# Altium schematic sheet Sheet1.SchDoc
size B; Author: E. Sims; Organization: Let's Build Rockets Inc.; SheetNumber: 1; SheetTotal: 3
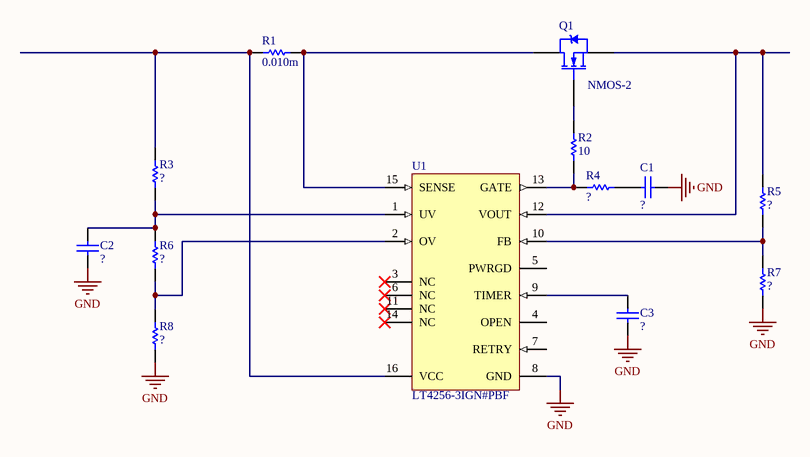
[diagram p0: Sheet1.SchDoc]

## Parts
C1  Cap  [RAD-0.3]  (value not drawn)
C2  Cap  [RAD-0.3]  (value not drawn)
C3  Cap  [RAD-0.3]  (value not drawn)
Q1  NMOS-2  [TO-220AB]
R1  value 0.010m  [AXIAL-0.3]  (hidden comment: Res1)
R2  value 10  [AXIAL-0.3]  (hidden comment: Res1)
R3  Res1  [AXIAL-0.3]  (value not drawn)
R4  Res1  [AXIAL-0.3]  (value not drawn)
R5  Res1  [AXIAL-0.3]  (value not drawn)
R6  Res1  [AXIAL-0.3]  (value not drawn)
R7  Res1  [AXIAL-0.3]  (value not drawn)
R8  Res1  [AXIAL-0.3]  (value not drawn)
U1  LT4256-3IGN#PBF  [LT-GN-16_L]

## Nets
GND: C1.1 C2.1 C3.1 R7.1 R8.1 U1.8(GND)
NetC1_2: C1.2 R4.1
NetC2_2: C2.2 R3.1 R6.2 U1.1(UV)
NetC3_2: C3.2 U1.9(TIMER)
NetQ1_1: Q1.1(G) R2.2
NetQ1_2: Q1.2(D) R1.2 U1.15(SENSE)
NetQ1_3: Q1.3(S) R5.2 U1.12(VOUT)
NetR1_1: R1.1 R3.2 U1.16(VCC)
NetR2_1: R2.1 R4.2 U1.13(GATE)
NetR5_1: R5.1 R7.2 U1.10(FB)
NetR6_1: R6.1 R8.2 U1.2(OV)

Not connected (* = marked no-connect by the designer): U1 3(NC)* 4(OPEN) 5(PWRGD) 6(NC)* 7(RETRY) 11(NC)* 14(NC)*

## Notes on the sheet
- Let's Build Rocket's Inc. Modular Paylaod System Based on TMP-010 Rev
  For more information visit https://github.com/LetsBuildRockets/Modular-Payload-System
  This work is licensed under CC BY-NC 4.0. To view a copy of this license, visit https://creativecommons.org/licenses/by-nc/4.0
- Title
- Size:
- Date:
- Assembly Variant:
- B
- Number:
- Time:
- Revision:
- Sheet
- of
- Author:
- File:

## Library data of the parts
C1-C3 = Cap: Capacitor; Published: 8-Jun-2000; LatestRevisionDate: 17-Jul-2002; LatestRevisionNote: Re-released for DXP Platform.; PackageReference: RAD-0.3; Publisher: Altium Limited; PackageDescription: Radial Cap, Thru-Hole; 2 Leads; 0.3 in Pin Spacing; Value: ?
Q1 = NMOS-2: N-Channel Power MOSFET; Note: Pin 2 is electrically connected to pin 4.; Published: 8-Jun-2000; LatestRevisionDate: 17-Jul-2002; LatestRevisionNote: Re-released for DXP Platform.; DatasheetVersion: PD-9.814; PackageVersion: Feb-1997; PackageReference: TO-220AB; Publisher: Altium Limited; PackageDescription: TO, Thru-Hole, Vertical, Heatsink Mounted; 3 In-Line Leads; Pitch 2.54 mm; ComponentLink1Description: Manufacturer Link; ComponentLink1URL: http://www.irf.com/
R1-R8 = Res1: Resistor; Published: 8-Jun-2000; LatestRevisionDate: 17-Jul-2002; LatestRevisionNote: Re-released for DXP Platform.; PackageReference: AXIAL-0.3; Publisher: Altium Limited; PackageDescription: Axial Device, Thru-Hole; 2 Leads; 0.3 in Pin Spacing
  R3-R8: Value: ?
U1 = CMP-0474-00283-1: Positive High Voltage Hot Swap Controller with Open-Circuit Detect, 10.8 to 80 V Vin, 16-pin SOP (GN-16), -40 to 85 degC, Pb-Free; Manufacturer: Linear Technology; Circuit Breaker Threshold: 55 mV; In-Rush Current: Active; Circuit Breaker Accuracy(%): 18; Active Limiting: yes; Fast Comparator: no; Extended Temp: C, I; Circuit Breakers(#): 1; PackageDescription: 16-Pin Plastic SSOP, Body 4.9 x 3.9 mm, Pitch 0.635 mm; DatasheetVersion: Rev. A; PartNumber: LT4256-3IGN#PBF; RoHS: TRUE; PackageVersion: Rev. B, 03/2012; ComponentLink1URL: http://www.linear.com/; Reset: no; ComponentLink2URL: http://cds.linear.com/docs/en/datasheet/42563fa.pm6.pdf; ComponentLink3URL: http://cds.linear.com/docs/en/packaging/05081641_B_GN16.pdf; Fault: no; ComponentLink1Description: Manufacturer URL; Vin Range: 10.8 to 80 V; ComponentLink2Description: Datasheet; PackageReference: GN-16; Power Good: yes; ComponentLink3Description: Package Specification; Mounting Technology: Surface Mount; Foldback: yes